# Altium project PCB_Project1.PrjPCB
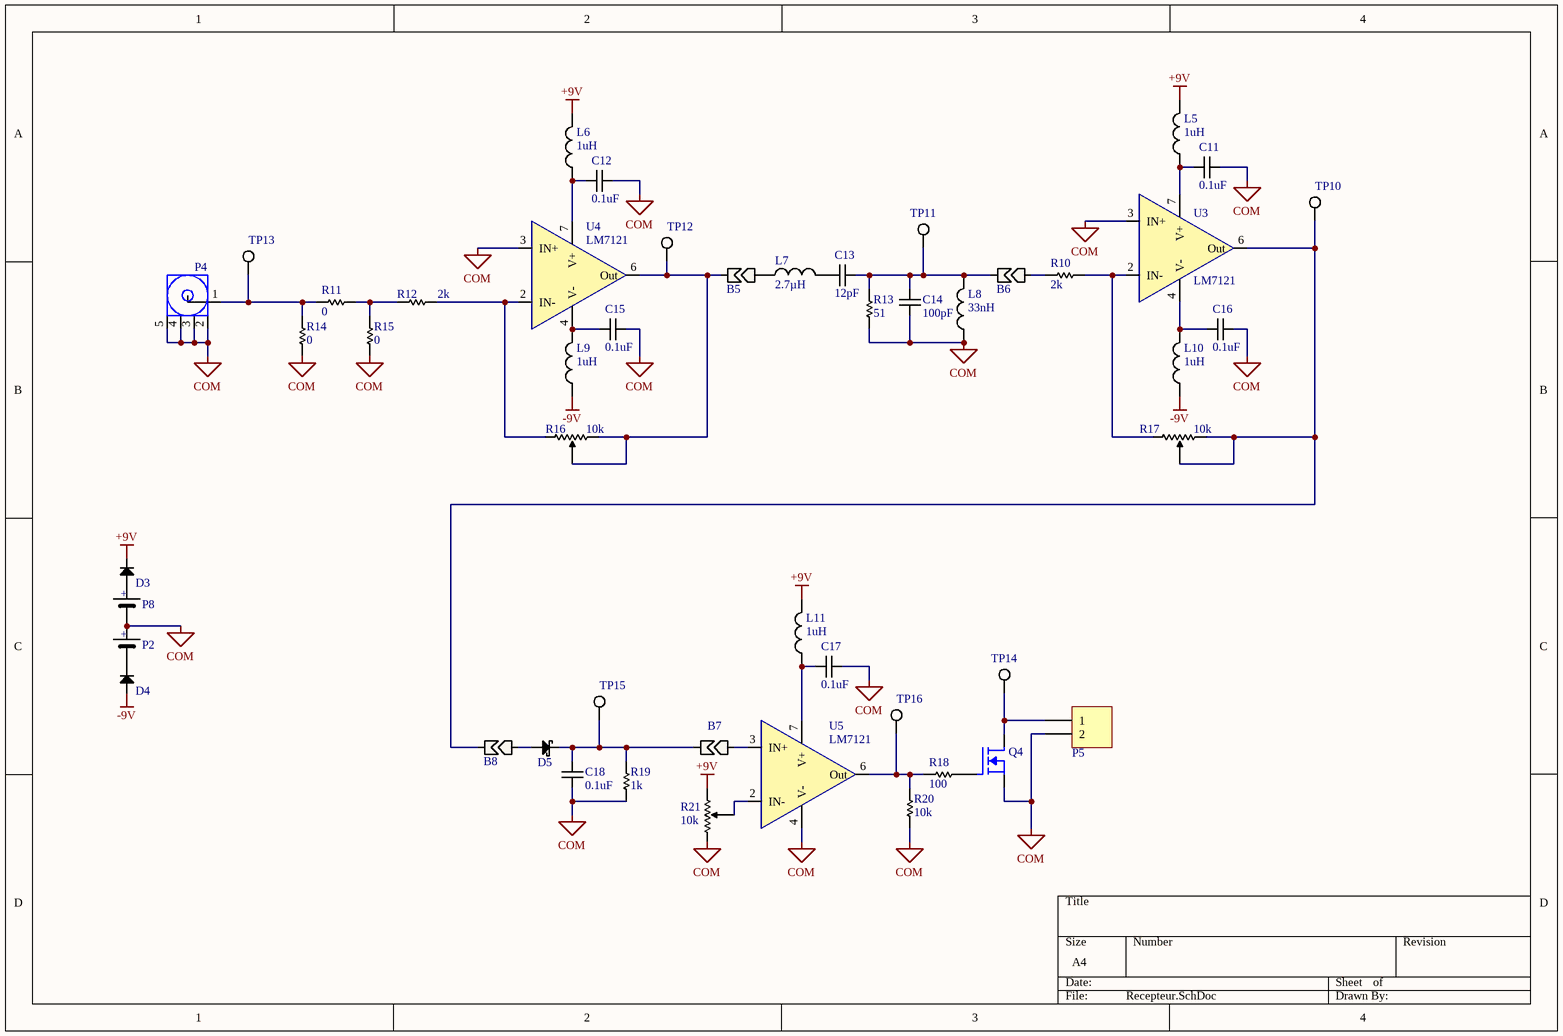
[diagram p0: Recepteur.SchDoc]
2 sheets, 98 parts. Net scope: global (net labels, ports and power ports of the same name join across sheets).
Sheets:
  Recepteur.SchDoc
  Emetteur.SchDoc

## Sheet Recepteur.SchDoc
size A4

### Parts
B5  BRIDGE  [BRIDGE_SMALL]  (value not drawn)
B6  BRIDGE  [BRIDGE_SMALL]  (value not drawn)
B7  BRIDGE  [BRIDGE_SMALL]  (value not drawn)
B8  BRIDGE  [BRIDGE_SMALL]  (value not drawn)
C11  0.1uF  [0805 - Cap Non-Polarized]
C12  0.1uF  [0805 - Cap Non-Polarized]
C13  12pF  [0805 - Cap Non-Polarized]
C14  100pF  [0805 - Cap Non-Polarized]
C15  0.1uF  [0805 - Cap Non-Polarized]
C16  0.1uF  [0805 - Cap Non-Polarized]
C17  0.1uF  [0805 - Cap Non-Polarized]
C18  0.1uF  [0805 - Cap Non-Polarized]
D3  Diode  [DOS-214AC (SMA)]  (value not drawn)
D4  Diode  [DOS-214AC (SMA)]  (value not drawn)
D5  Diode Schottky  [SMBflat]  (value not drawn)
L5  1uH  [1008 - INDUCTOR]
L6  1uH  [1008 - INDUCTOR]
L7  2.7µH  [1812 - Inductor]
L8  33nH  [1008 - INDUCTOR]
L9  1uH  [1008 - INDUCTOR]
L10  1uH  [1008 - INDUCTOR]
L11  1uH  [1008 - INDUCTOR]
P2  Battery Holder  [Battery Holder - 9V - THT]  (value not drawn)
P4  Coax-F  [Coax-BNC-THT-Vertical]  (value not drawn)
P5  Header 1X2  [Headers - 1x2 - R/A - Lock]  (value not drawn)
P8  Battery Holder  [Battery Holder - 9V - THT]  (value not drawn)
Q4  MOSFET_N  [SOT23-3]  (value not drawn)
R10  2k  [0805 - Resistor]
R11  0  [0805 - Resistor]
R12  2k  [0805 - Resistor]
R13  51  [0805 - Resistor]
R14  0  [0805 - Resistor]
R15  0  [0805 - Resistor]
R16  value 10k  [TT-67Y]  (hidden comment: Pot)
R17  value 10k  [TT-67Y]  (hidden comment: Pot)
R18  100  [0805 - Resistor]
R19  1k  [0805 - Resistor]
R20  10k  [0805 - Resistor]
R21  value 10k  [TT-67Y]  (hidden comment: Pot)
TP10  TP  [TP-THT-Vertical-1]  (value not drawn)
TP11  TP  [TP-THT-Vertical-1]  (value not drawn)
TP12  TP  [TP-THT-Vertical-1]  (value not drawn)
TP13  TP  [TP-THT-Vertical-1]  (value not drawn)
TP14  TP  [TP-THT-Vertical-1]  (value not drawn)
TP15  TP  [TP-THT-Vertical-1]  (value not drawn)
TP16  TP  [TP-THT-Vertical-1]  (value not drawn)
U3  LM7121  [SOIC8 - 0.150]
U4  LM7121  [SOIC8 - 0.150]
U5  LM7121  [SOIC8 - 0.150]

### Nets
+9V: D3.2(K) L5.2 L6.2 L11.2 R21.1
-9V: D4.1(A) L9.1 L10.1
COM: C11.2 C12.2 C14.1 C15.2 C16.2 C17.2 C18.1 L8.1 P2.1(+) P4.2(GND) P4.3(GND) P4.4(GND) P4.5(GND) P5.2 P8.2(-) Q4.2(S) R13.1 R14.1 R15.2 R19.1 R20.1 R21.3 U3.3(IN+) U4.3(IN+) U5.4(V-)
NetB5_1: B5.1 R16.1 R16.2(Wiper) TP12.1 U4.6(Out)
NetB5_2: B5.2 L7.1
NetB6_1: B6.1 C13.2 C14.2 L8.2 R13.2 TP11.1
NetB6_2: B6.2 R10.2
NetB7_1: B7.1 C18.2 D5.2(K) R19.2 TP15.1
NetB7_2: B7.2 U5.3(IN+)
NetB8_1: B8.1 R17.1 R17.2(Wiper) TP10.1 U3.6(Out)
NetB8_2: B8.2 D5.1(A)
NetC11_1: C11.1 L5.1 U3.7(V+)
NetC12_1: C12.1 L6.1 U4.7(V+)
NetC13_1: C13.1 L7.2
NetC15_1: C15.1 L9.2 U4.4(V-)
NetC16_1: C16.1 L10.2 U3.4(V-)
NetC17_1: C17.1 L11.1 U5.7(V+)
NetD3_1: D3.1(A) P8.1(+)
NetD4_2: D4.2(K) P2.2(-)
NetP4_1: P4.1(Signal) R11.1 R14.2 TP13.1
NetP5_1: P5.1 Q4.3(D) TP14.1
NetQ4_1: Q4.1(G) R18.1
NetR10_1: R10.1 R17.3 U3.2(IN-)
NetR11_2: R11.2 R12.2 R15.1
NetR12_1: R12.1 R16.3 U4.2(IN-)
NetR18_2: R18.2 R20.2 TP16.1 U5.6(Out)
NetR21_2: R21.2(Wiper) U5.2(IN-)

### Library data of the parts
B5-B8 = Jumper-solder: Solder Jumper Bridge; Part Number: Jumper-solder; Category: Jumper; Sub Category: Jumper; Pin count: 2; Created by: Fred; Height: 1mm
C11 C12 C15-C18 = Cap-TDK-CGA-0.1uF-0805: CAP CER 0.1UF 100V 10% X7R 0805; Manufacturer: TDK; Manufacturer No: CGA4J2X7R2A104K125AA; Sub Category: 0805; Part Number: Cap-TDK-CGA-0.1uF-0805; Category: Capacitor; Pin count: 2; Package: 0805; Series: CGA; Supplier 1: Digi-Key; Supplier Part Number 1: 445-5827-1-ND; ComponentLink1URL: http://product.tdk.com/capacitor/mlcc/en/documents/mlcc_automotive_midvoltage_en.pdf; ComponentLink1Description: Datasheet; Creation Date: 2013-09-19 19:23:33; Created by: Pier-Yves; Value: 0.1uF; Tolerance: 10%; Height: 1.45mm; Voltage: 100V; Temperature: -55°C ~ 125°C
C13 = Cap-TDK-CGA-12pF-0805: CAP CER 12PF 100V 5% NP0 0603; Manufacturer: TDK; Manufacturer No: CGA3E2C0G2A120J080AA; Sub Category: 0805; Part Number: Cap-TDK-CGA-12pF-0805; Category: Capacitor; Pin count: 2; Package: 0805; Series: CGA; Supplier 1: Digi-Key; Supplier Part Number 1: 445-12319-1-ND; ComponentLink1URL: http://product.tdk.com/capacitor/mlcc/en/documents/mlcc_automotive_midvoltage_en.pdf; ComponentLink1Description: Datasheet; Creation Date: 2013-09-25 17:50:57; Created by: Pier-Yves; Value: 12pF; Tolerance: ±5%; Height: 1.45mm; Voltage: 100V; Temperature: MLCC
C14 = Cap-TDK-CGA-100pF-0805: CAP CER 100PF 100V 5% NP0 0805; Manufacturer: TDK; Manufacturer No: CGA4C2C0G2A101J060AA; Sub Category: 0805; Part Number: Cap-TDK-CGA-100pF-0805; Category: Capacitor; Pin count: 2; Package: 0805; Series: CGA; Supplier 1: Digi-Key; Supplier Part Number 1: 445-6951-1-ND; ComponentLink1URL: http://product.tdk.com/capacitor/mlcc/en/documents/mlcc_automotive_midvoltage_en.pdf; ComponentLink1Description: Datasheet; Creation Date: 2013-09-19 19:23:33; Created by: Pier-Yves; Value: 100pF; Tolerance: 5%; Height: 1.45mm; Voltage: 100V; Temperature: MLCC
D3 D4 = S1M-13-F: DIODE GEN PURPOSE 1000V 1A SMA; Manufacturer: Diodes Inc.; Manufacturer No: BAS21LT3G; Sub Category: Single; Value: 1.1V@1A; Voltage: 1.1V @ 1A; Part Number: S1M-13-F; Category: Diode; Pin count: 2; Package: SMA; Supplier 1: Digi-Key; Supplier Part Number 1: S1M-FDICT-ND; ComponentLink1URL: http://www.diodes.com/datasheets/ds16003.pdf; ComponentLink1Description: Datasheet; Creation Date: 2013-10-21 20:14:01; Created by: Pier-Yves; Current: 1A; Temperature: -55°C ~ 150°C
D5 = STPS2L40UF: DIODE SCHOTTKY 40V 2A SMBFLAT; Manufacturer: STMicroelectronics; Sub Category: Shottky; Value: 430mV @ 2A; Part Number: STPS2L40UF; Category: Diode; Pin count: 2; Package: SMBflat; Manufacturer No: STPS2L40UF; Supplier 1: Digi-Key; Supplier Part Number 1: 497-8031-1-ND; ComponentLink1URL: http://www.st.com/web/en/resource/technical/document/datasheet/CD00002299.pdf; ComponentLink1Description: Datasheet; Creation Date: 2013-11-30 15:18:00; Created by: Pier-Yves; Height: 1.1mm; Voltage: 430mV @ 2A; Current: 2A; Temperature: 150°C
L5 L6 L9-L11 = Murata-LQW2UA-Ind-AirCore-1uH: IND 1000NH 370MA SRF 290MHZ 1008; Manufacturer: Murata Electronics North America; Manufacturer No: LQW2UAS1R0J00L; Sub Category: SMD; Tolerance: 5%; Part Number: Murata-LQW2UA-Ind-AirCore-1uH; Category: Inductor; Pin count: 2; Package: 2520; Series: LQW2UA; Supplier 1: Digi-Key; Supplier Part Number 1: 490-5706-1-ND; ComponentLink1URL: http://search.murata.co.jp/Ceramy/image/img/PDF/ENG/L0075S0080LQW2UA.pdf; ComponentLink1Description: Datasheet; Creation Date: 2013-09-12 02:00:35; Created by: Frederic; Value: 1uH; Height: 1.83mm; Current: 370mA; Temperature: -55°C ~ 125°C
L7 = Ind-Panasonic-FB-2.7µH-1812: INDUCTOR 2.7 UH 10% 1812 SMD; Manufacturer: Panasonic Electronic Components; Manufacturer No: ELJ-FB2R7KF; Sub Category: 1812; Current: 400mA; Part Number: Ind-Panasonic-FB-2.7µH-1812; Category: Inductor; Pin count: 2; Package: 1812; Series: FB; Supplier 1: Digi-Key; Supplier Part Number 1: PCD1446CT-ND; ComponentLink1URL: http://industrial.panasonic.com/www-cgi/jvcr13pz.cgi?E+PZ+3+AGA0031+ELJFB2R7KF+7+WW; ComponentLink1Description: Datasheet; Creation Date: 2013-09-26 18:57:04; Created by: Pier-Yves; Value: 2.7µH; Tolerance: ±10%; Height: 3.4mm; Temperature: -20°C ~ 85°C
L8 = Murata-LQW2UA-Ind-AirCore-33nH: IND 33NH 1000MA SRF 1600MHZ 1008; Manufacturer: Murata Electronics North America; Manufacturer No: LQW2UAS33NJ00L; Sub Category: SMD; Tolerance: 5%; Current: 1A; Part Number: Murata-LQW2UA-Ind-AirCore-33nH; Category: Inductor; Pin count: 2; Package: 2520; Series: LQW2UA; Supplier 1: Digi-Key; Supplier Part Number 1: 490-5685-1-ND; ComponentLink1URL: http://search.murata.co.jp/Ceramy/image/img/PDF/ENG/L0075S0080LQW2UA.pdf; ComponentLink1Description: Datasheet; Creation Date: 2013-09-12 02:00:31; Created by: Frederic; Value: 33nH; Height: 1.83mm; Temperature: -55°C ~ 125°C
P2 P8 = Battery Holder-9V-THT-Open: HOLDER BATTERY 9V PC MOUNT; Manufacturer: MPD; Manufacturer No: BC9VPC; Part Number: Battery Holder-9V-THT-Open; Category: Battery Holder; Pin count: 2; Supplier 1: Digi-Key; Supplier Part Number 1: BC9VPC-ND; ComponentLink1URL: http://www.memoryprotectiondevices.com/datasheets/BC9VPC-datasheet.pdf; ComponentLink1Description: Datasheet; Creation Date: 2013-10-01 13:40:00; Created by: Pier-Yves; Value: 9V; Height: 21.41mm; Voltage: 9V
P4 = coax-bnc-tht-vertical: CONN BNC JACK STR 50 OHM PCB; Manufacturer: TE Connectivity; Manufacturer No: 5-1634503-1; Sub Category: Coaxial; Value: 50Ohms; Part Number: coax-bnc-tht-vertical; Category: Connector; Pin count: 5; Series: AMP; Supplier 1: Digi-Key; Supplier Part Number 1: A97581-ND; ComponentLink1URL: http://www.te.com/commerce/DocumentDelivery/DDEController?Action=srchrtrv&DocNm=1634503&DocType=Customer+Drawing&DocLang=English; ComponentLink1Description: Datasheet; Creation Date: 2013-11-24 21:41:14; Created by: Pier-Yves; Temperature: -55°C ~ 85°C
P5 = Header-0.100-R/A-Lock-1X2: Manufacturer: Molex Inc.; Manufacturer No: 0705530001; Sub Category: 100mils R/A lock; LatestRevisionDate: 17-Jul-2002; LatestRevisionNote: Re-released for DXP Platform.; Publisher: Altium Limited; Part Number: Header-0.100-R/A-Lock-1X2; Category: Header; Pin count: 2; Series: C-Grid® SL™ 70553; Supplier 1: Digi-Key; Supplier Part Number 1: WM4900-ND; ComponentLink1URL: http://www.molex.com/pdm_docs/sd/705530001_sd.pdf; ComponentLink1Description: Datasheet; Creation Date: 2013-06-28 14:36:17; Created by: Pier-Yves
Q4 = 2N7002: MosFET Channel-N SOT-23-3 3.3A; Part Number: 2N7002; Manufacturer: Vishay Siliconix; Manufacturer No: SI2304DDS-T1-GE3; Sub Category: MOSFET-N; Value: Channel N; Power: 1.7W; Voltage: 30V; Category: Transistor; Pin count: 3; Package: SOT-23-3; Series: ÉTrenchFET; Supplier 1: Digi-Key; Supplier Part Number 1: SI2304DDS-T1-GE3CT-ND; ComponentLink1URL: http://www.vishay.com/docs/65175/si2304dd.pdf; ComponentLink1Description: Datasheet; Creation Date: 2013-06-28 13:51:31; Created by: Pier-Yves; Current: 3.3A
R10 R12 = Yagao-RC0805-2k: RES 2.0K OHM 1/8W 5% 0805 SMD; Manufacturer: Yagao; Manufacturer No: RC0805JR-072KL; Sub Category: 0805; Part Number: Yagao-RC0805-2k; Category: Resistor; Pin count: 2; Package: 0805; Series: RC0805; Supplier 1: Digi-Key; Supplier Part Number 1: 311-2.0KARCT-ND; ComponentLink1URL: http://media.digikey.com/pdf/Data%20Sheets/Yageo%20PDFs/RC0805%20Pb%20Free.pdf; ComponentLink1Description: Datasheet; Creation Date: 2013-06-28 03:21:03; Created by: Pier-Yves; Value: 2k; Tolerance: 5%; Power: 1/8W; Height: 0.6mm
R11 R14 R15 = Jumper-0805: RES 0.0 OHM 1/8W JUMP 0805; Manufacturer: Stackpole electronic; Manufacturer No: RMCF0805ZT0R00; Sub Category: 0805; Current: 2A; Part Number: Jumper-0805; Category: Resistor; Pin count: 2; Package: 0805; Series: RMFC; Supplier 1: Digi-Key; Supplier Part Number 1: RMCF0805ZT0R00CT-ND; ComponentLink1URL: http://www.seielect.com/Catalog/SEI-RMCF_RMCP.pdf; ComponentLink1Description: Datasheet; Creation Date: 2013-09-21 02:33:24; Created by: Pier-Yves; Value: 0; Power: 1/8W; Height: 0.65mm
R13 = Yagao-RC0805-51: RES 51 OHM 1/8W 5% 0805 SMD; Manufacturer: Yagao; Manufacturer No: RC0805JR-0751RL; Sub Category: 0805; Part Number: Yagao-RC0805-51; Category: Resistor; Pin count: 2; Package: 0805; Series: RC0805; Supplier 1: Digi-Key; Supplier Part Number 1: 311-51ARCT-ND; ComponentLink1URL: http://media.digikey.com/pdf/Data%20Sheets/Yageo%20PDFs/RC0805%20Pb%20Free.pdf; ComponentLink1Description: Datasheet; Creation Date: 2013-06-28 03:21:03; Created by: Pier-Yves; Value: 51; Tolerance: 5%; Power: 1/8W; Height: 0.6mm
R16 R17 R21 = Pot-TT67Y-20Turns-THT-10%-10k: TRIMMER 10K OHM 0.5W TH; Manufacturer: TT Electronics; Manufacturer No: 67YR10KLF; Sub Category: Through Hole; Tolerance: 10%; Power: 1/2W; Part Number: Pot-TT67Y-20Turns-THT-10%-10k; Category: Potentiometer; Pin count: 3; Series: 67; Supplier 1: Digi-Key; Supplier Part Number 1: 987-1098-ND; ComponentLink1URL: http://www.bitechnologies.com/pdfs/67.pdf; ComponentLink1Description: Datasheet; Creation Date: 2013-11-26 20:09:06; Created by: Pier-Yves; Height: 10.4mm
R18 = Yagao-RC0805-100: RES 100 OHM 1/8W 5% 0805 SMD; Manufacturer: Yagao; Manufacturer No: RC0805JR-07100RL; Sub Category: 0805; Part Number: Yagao-RC0805-100; Category: Resistor; Pin count: 2; Package: 0805; Series: RC0805; Supplier 1: Digi-Key; Supplier Part Number 1: 311-100ARCT-ND; ComponentLink1URL: http://media.digikey.com/pdf/Data%20Sheets/Yageo%20PDFs/RC0805%20Pb%20Free.pdf; ComponentLink1Description: Datasheet; Creation Date: 2013-06-28 03:21:03; Created by: Pier-Yves; Value: 100; Tolerance: 5%; Power: 1/8W; Height: 0.6mm
R19 = Yagao-RC0805-1k: RES 1.0K OHM 1/8W 5% 0805 SMD; Manufacturer: Yagao; Manufacturer No: RC0805JR-071KL; Sub Category: 0805; Part Number: Yagao-RC0805-1k; Category: Resistor; Pin count: 2; Package: 0805; Series: RC0805; Supplier 1: Digi-Key; Supplier Part Number 1: 311-1.0KARCT-ND; ComponentLink1URL: http://media.digikey.com/pdf/Data%20Sheets/Yageo%20PDFs/RC0805%20Pb%20Free.pdf; ComponentLink1Description: Datasheet; Creation Date: 2013-06-28 03:21:03; Created by: Pier-Yves; Value: 1k; Tolerance: 5%; Power: 1/8W; Height: 0.6mm
R20 = Yagao-RC0805-10k: RES 10K OHM 1/8W 5% 0805 SMD; Manufacturer: Yagao; Manufacturer No: RC0805JR-0710KL; Sub Category: 0805; Part Number: Yagao-RC0805-10k; Category: Resistor; Pin count: 2; Package: 0805; Series: RC0805; Supplier 1: Digi-Key; Supplier Part Number 1: 311-10KARCT-ND; ComponentLink1URL: http://media.digikey.com/pdf/Data%20Sheets/Yageo%20PDFs/RC0805%20Pb%20Free.pdf; ComponentLink1Description: Datasheet; Creation Date: 2013-06-28 03:21:03; Created by: Pier-Yves; Value: 10k; Tolerance: 5%; Power: 1/8W; Height: 0.6mm
TP10-TP16 = TP-THT-Vertical-1: TEST POINT PC COMPACT .063"D BLK; Manufacturer: Keystone Electronics; Manufacturer No: 5006; Part Number: TP-THT-Vertical-1; Category: Test Point; Pin count: 1; Series: THM; Supplier 1: Digi-Key; Supplier Part Number 1: 5006K-ND; ComponentLink1URL: http://www.keyelco.com/userAssets/file/M60-2p60.pdf; ComponentLink1Description: Datasheet; Creation Date: 2013-11-26 21:36:04; Created by: Pier-Yves; Height: 5.6mm
U3-U5 = LM7121-8SOIC: IC OPAMP VFB 175MHZ 8SOIC; Manufacturer: Texas Instrument; Manufacturer No: LM7121IM/NOPB; Voltage: ±2.25V ~ 16.5V; Part Number: LM7121-8SOIC; Category: IC; Sub Category: OpAmp; Pin count: 8; Package: SOIC-8; Supplier 1: Digi-Key; Supplier Part Number 1: LM7121IM/NOPB-ND; ComponentLink1URL: http://www.ti.com/lit/ds/symlink/lm7121.pdf; ComponentLink1Description: Datasheet; Creation Date: 2013-11-26 17:11:13; Created by: Pier-Yves; Temperature: -40°C ~ 85°C

## Sheet Emetteur.SchDoc
size A4
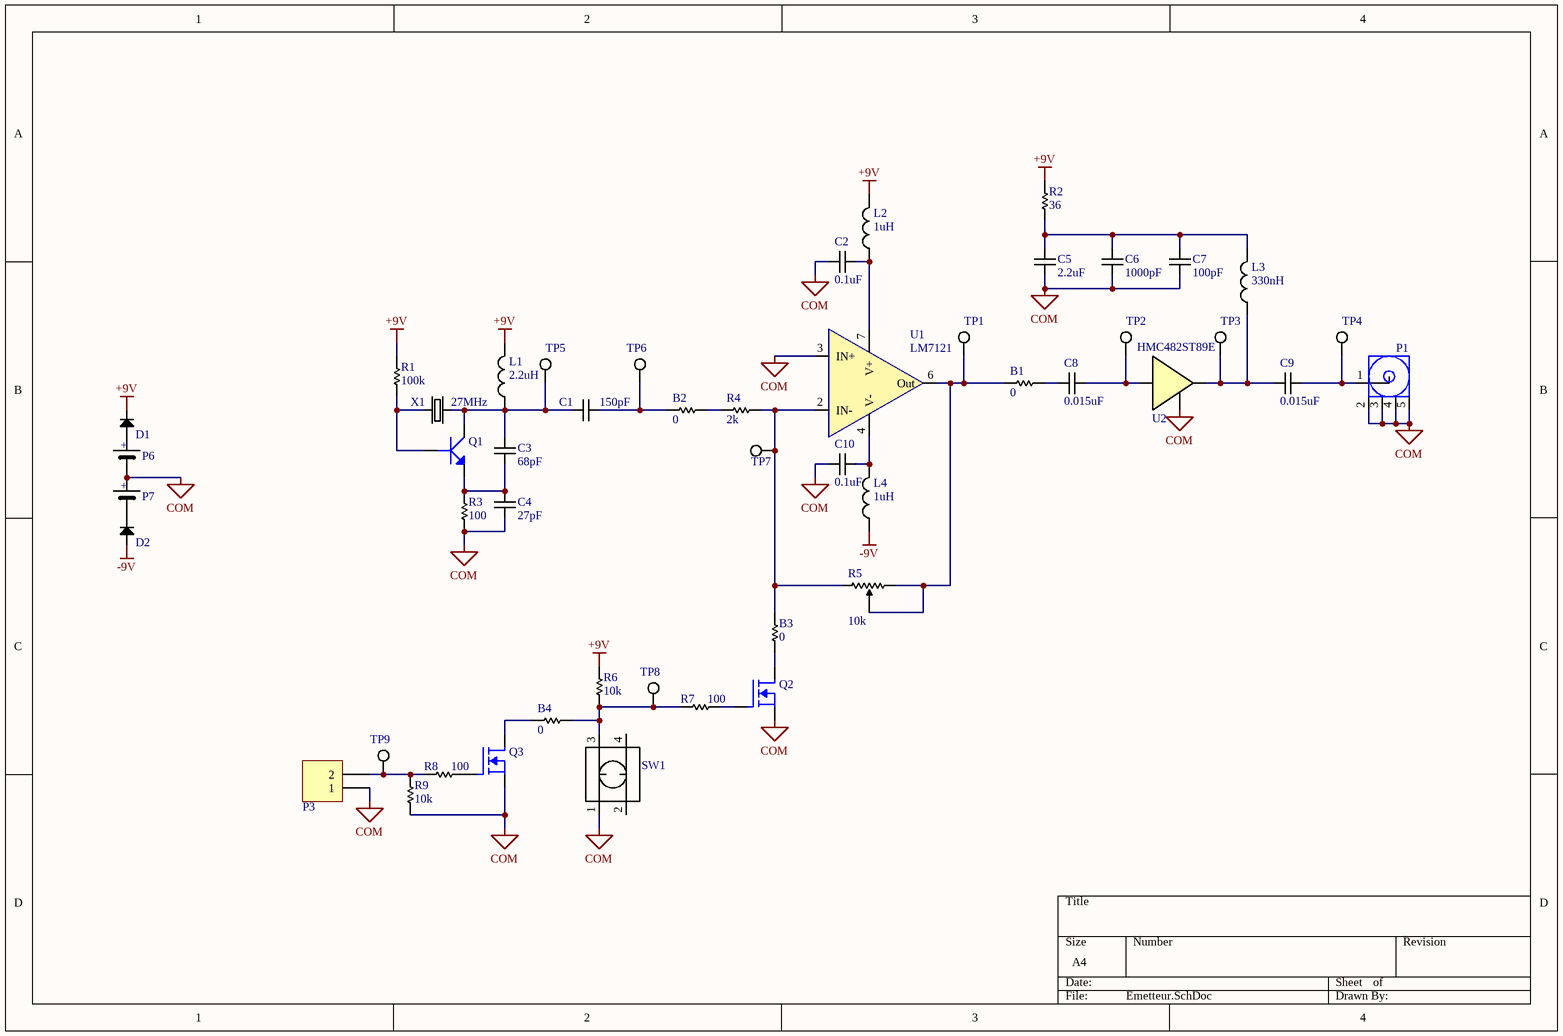
[diagram p1: Emetteur.SchDoc]

### Parts
B1  0  [0805 - Resistor]
B2  0  [0805 - Resistor]
B3  0  [0805 - Resistor]
B4  0  [0805 - Resistor]
C1  value 150pF  [0805 - Cap Non-Polarized]  (hidden comment: Cap)
C2  0.1uF  [0805 - Cap Non-Polarized]
C3  value 68pF  [0805 - Cap Non-Polarized]  (hidden comment: Cap)
C4  value 27pF  [0805 - Cap Non-Polarized]  (hidden comment: Cap)
C5  2.2uF  [0805 - Cap Non-Polarized]
C6  1000pF  [0805 - Cap Non-Polarized]
C7  100pF  [0805 - Cap Non-Polarized]
C8  0.015uF  [0805 - Cap Non-Polarized]
C9  0.015uF  [0805 - Cap Non-Polarized]
C10  0.1uF  [0805 - Cap Non-Polarized]
D1  Diode  [DOS-214AC (SMA)]  (value not drawn)
D2  Diode  [DOS-214AC (SMA)]  (value not drawn)
L1  value 2.2uH  [1008 - INDUCTOR]  (hidden comment: Inductor)
L2  1uH  [1008 - INDUCTOR]
L3  330nH  [1008 - INDUCTOR]
L4  1uH  [1008 - INDUCTOR]
P1  Coax-F  [Coax-BNC-THT-Vertical]  (value not drawn)
P3  Header 1X2  [Headers - 1x2 - R/A - Lock]  (value not drawn)
P6  Battery Holder  [Battery Holder - 9V - THT]  (value not drawn)
P7  Battery Holder  [Battery Holder - 9V - THT]  (value not drawn)
Q1  NPN  [SOT23-3]  (value not drawn)
Q2  MOSFET_N  [SOT23-3]  (value not drawn)
Q3  MOSFET_N  [SOT23-3]  (value not drawn)
R1  value 100k  [0805 - Resistor]  (hidden comment: Res)
R2  36  [2512 - Resistor]
R3  value 100  [0805 - Resistor]  (hidden comment: Res)
R4  2k  [0805 - Resistor]
R5  value 10k  [TT-67Y]  (hidden comment: Pot)
R6  10k  [0805 - Resistor]
R7  100  [0805 - Resistor]
R8  100  [0805 - Resistor]
R9  10k  [0805 - Resistor]
SW1  Tact Switch 4  [TE FSMJSMA]  (value not drawn)
TP1  TP  [TP-THT-Vertical-1]  (value not drawn)
TP2  TP  [TP-THT-Vertical-1]  (value not drawn)
TP3  TP  [TP-THT-Vertical-1]  (value not drawn)
TP4  TP  [TP-THT-Vertical-1]  (value not drawn)
TP5  TP  [TP-THT-Vertical-1]  (value not drawn)
TP6  TP  [TP-THT-Vertical-1]  (value not drawn)
TP7  TP  [TP-THT-Vertical-1]  (value not drawn)
TP8  TP  [TP-THT-Vertical-1]  (value not drawn)
TP9  TP  [TP-THT-Vertical-1]  (value not drawn)
U1  LM7121  [SOIC8 - 0.150]
U2  Manufacturer No: HMC482ST89E  [SOT-89]  (hidden comment: Buffer)
X1  value 27MHz  [HC49US]  (hidden comment: HC49US)

### Nets
+9V: D1.2(K) L1.2 L2.2 R1.2 R2.1 R6.2
-9V: D2.1(A) L4.1
COM: C2.1 C4.1 C5.1 C6.1 C7.1 C10.1 P1.2(GND) P1.3(GND) P1.4(GND) P1.5(GND) P3.1 P6.2(-) P7.1(+) Q2.2(S) Q3.2(S) R3.1 R9.1 SW1.1 U1.3(IN+) U2.2(Gnd)
NetB1_1: B1.1 R5.1 R5.2(Wiper) TP1.1 U1.6(Out)
NetB1_2: B1.2 C8.1
NetB2_1: B2.1 C1.2 TP6.1
NetB2_2: B2.2 R4.2
NetB3_1: B3.1 Q2.3(D)
NetB3_2: B3.2 R4.1 R5.3 TP7.1 U1.2(IN-)
NetB4_1: B4.1 Q3.3(D)
NetB4_2: B4.2 R6.1 R7.1 SW1.3 TP8.1
NetC1_1: C1.1 C3.2 L1.1 Q1.3(C) TP5.1 X1.2
NetC2_2: C2.2 L2.1 U1.7(V+)
NetC3_1: C3.1 C4.2 Q1.2(E) R3.2
NetC5_2: C5.2 C6.2 C7.2 L3.2 R2.2
NetC8_2: C8.2 TP2.1 U2.1(In)
NetC9_1: C9.1 L3.1 TP3.1 U2.3(Out)
NetC9_2: C9.2 P1.1(Signal) TP4.1
NetC10_2: C10.2 L4.2 U1.4(V-)
NetD1_1: D1.1(A) P6.1(+)
NetD2_2: D2.2(K) P7.2(-)
NetP3_2: P3.2 R8.1 R9.2 TP9.1
NetQ1_1: Q1.1(B) R1.1 X1.1
NetQ2_1: Q2.1(G) R7.2
NetQ3_1: Q3.1(G) R8.2

Not connected (* = marked no-connect by the designer): SW1 2 4

### Library data of the parts
B1-B4 = Jumper-0805: as R11 on sheet Recepteur; Part Number: Jumper-0805; Category: Resistor; Pin count: 2; Package: 0805; Series: RMFC; Supplier 1: Digi-Key; Supplier Part Number 1: RMCF0805ZT0R00CT-ND; ComponentLink1URL: http://www.seielect.com/Catalog/SEI-RMCF_RMCP.pdf; ComponentLink1Description: Datasheet; Creation Date: 2013-09-21 02:33:24; Created by: Pier-Yves; Value: 0; Power: 1/8W; Height: 0.65mm
C1 = Cap-TDK-CGA-150pF-0805: CAP CER 150PF 250V 5% NP0 0603; Manufacturer: TDK; Manufacturer No: CGA3E3C0G2E151J080AA; Sub Category: 0805; Part Number: Cap-TDK-CGA-150pF-0805; Category: Capacitor; Pin count: 2; Package: 0805; Series: CGA; Supplier 1: Digi-Key; Supplier Part Number 1: 445-5740-1-ND; ComponentLink1URL: http://product.tdk.com/capacitor/mlcc/en/documents/mlcc_automotive_midvoltage_en.pdf; ComponentLink1Description: Datasheet; Creation Date: 2013-09-25 17:50:57; Created by: Pier-Yves; Tolerance: ±5%; Height: 1.45mm; Voltage: 250V; Temperature: MLCC
C2 C10 = Cap-TDK-CGA-0.1uF-0805: as C11 on sheet Recepteur; Part Number: Cap-TDK-CGA-0.1uF-0805; Category: Capacitor; Pin count: 2; Package: 0805; Series: CGA; Supplier 1: Digi-Key; Supplier Part Number 1: 445-5827-1-ND; ComponentLink1URL: http://product.tdk.com/capacitor/mlcc/en/documents/mlcc_automotive_midvoltage_en.pdf; ComponentLink1Description: Datasheet; Creation Date: 2013-09-19 19:23:33; Created by: Pier-Yves; Value: 0.1uF; Tolerance: 10%; Height: 1.45mm; Voltage: 100V; Temperature: -55°C ~ 125°C
C3 = Cap-TDK-CGA-68pF-0805: CAP CER 68PF 100V 5% NP0 0603; Manufacturer: TDK; Manufacturer No: CGA3E2C0G2A680J080AA; Sub Category: 0805; Part Number: Cap-TDK-CGA-68pF-0805; Category: Capacitor; Pin count: 2; Package: 0805; Series: CGA; Supplier 1: Digi-Key; Supplier Part Number 1: 445-12337-1-ND; ComponentLink1URL: http://product.tdk.com/capacitor/mlcc/en/documents/mlcc_automotive_midvoltage_en.pdf; ComponentLink1Description: Datasheet; Creation Date: 2013-09-25 17:50:57; Created by: Pier-Yves; Tolerance: ±5%; Height: 1.45mm; Voltage: 100V; Temperature: MLCC
C4 = Cap-TDK-CGA-27pF-0805: CAP CER 27PF 50V 5% NP0 0603; Manufacturer: TDK; Manufacturer No: CGA3E2C0G1H270J080AA; Sub Category: 0805; Part Number: Cap-TDK-CGA-27pF-0805; Category: Capacitor; Pin count: 2; Package: 0805; Series: CGA; Supplier 1: Digi-Key; Supplier Part Number 1: 445-5633-1-ND; ComponentLink1URL: http://product.tdk.com/capacitor/mlcc/en/documents/mlcc_automotive_general_en.pdf; ComponentLink1Description: Datasheet; Creation Date: 2013-09-25 17:50:57; Created by: Pier-Yves; Tolerance: ±5%; Height: 1.45mm; Voltage: 50V; Temperature: MLCC
C5 = Cap-Samsung-CL-50V-2.2uF-0805-10%: CAP CER 2.2UF 50V 10% X5R 0805; Manufacturer: Samsung Electro-Mechanics America, Inc; Manufacturer No: CL21A225KB9LNNC; Sub Category: 0805; Part Number: Cap-Samsung-CL-50V-2.2uF-0805-10%; Category: Capacitor; Pin count: 2; Package: 0805; Series: CL; Supplier 1: Digi-Key; Supplier Part Number 1: 1276-2409-1-ND; ComponentLink1URL: http://www.samsungsem.com/servlet/FileDownload?type=spec&file=CL21A225KB9LNNC.pdf; ComponentLink1Description: Datasheet; Creation Date: 2013-11-14 02:22:00; Created by: Pier-Yves; Value: 2.2uF; Tolerance: 10%; Height: 1.45mm; Voltage: 50V; Temperature: -55°C ~ 85°C
C6 = Cap-TDK-CGA-1000pF-0805: CAP CER 1000PF 100V 5% NP0 0805; Manufacturer: TDK; Manufacturer No: CGA4C2C0G2A102J060AA; Sub Category: 0805; Part Number: Cap-TDK-CGA-1000pF-0805; Category: Capacitor; Pin count: 2; Package: 0805; Series: CGA; Supplier 1: Digi-Key; Supplier Part Number 1: 445-5749-1-ND; ComponentLink1URL: http://product.tdk.com/capacitor/mlcc/en/documents/mlcc_automotive_midvoltage_en.pdf; ComponentLink1Description: Datasheet; Creation Date: 2013-09-19 19:23:33; Created by: Pier-Yves; Value: 1000pF; Tolerance: 5%; Height: 1.45mm; Voltage: 100V; Temperature: MLCC
C7 = Cap-TDK-CGA-100pF-0805: as C14 on sheet Recepteur; Part Number: Cap-TDK-CGA-100pF-0805; Category: Capacitor; Pin count: 2; Package: 0805; Series: CGA; Supplier 1: Digi-Key; Supplier Part Number 1: 445-6951-1-ND; ComponentLink1URL: http://product.tdk.com/capacitor/mlcc/en/documents/mlcc_automotive_midvoltage_en.pdf; ComponentLink1Description: Datasheet; Creation Date: 2013-09-19 19:23:33; Created by: Pier-Yves; Value: 100pF; Tolerance: 5%; Height: 1.45mm; Voltage: 100V; Temperature: MLCC
C8 C9 = Cap-TDK-CGA-0.015uF-0805: CAP CER 0.015UF 100V X7R 0805; Manufacturer: TDK; Manufacturer No: CGA4J2X7R2A153K125AA; Sub Category: 0805; Tolerance: 10%; Part Number: Cap-TDK-CGA-0.015uF-0805; Category: Capacitor; Pin count: 2; Package: 0805; Series: CGA; Supplier 1: Digi-Key; Supplier Part Number 1: 445-5822-1-ND; ComponentLink1URL: http://product.tdk.com/capacitor/mlcc/en/documents/mlcc_automotive_midvoltage_en.pdf; ComponentLink1Description: Datasheet; Creation Date: 2013-09-19 19:23:33; Created by: Pier-Yves; Value: 0.015uF; Height: 1.45mm; Voltage: 100V; Temperature: -55°C ~ 125°C
D1 D2 = S1M-13-F: as D3 on sheet Recepteur; Part Number: S1M-13-F; Category: Diode; Pin count: 2; Package: SMA; Supplier 1: Digi-Key; Supplier Part Number 1: S1M-FDICT-ND; ComponentLink1URL: http://www.diodes.com/datasheets/ds16003.pdf; ComponentLink1Description: Datasheet; Creation Date: 2013-10-21 20:14:01; Created by: Pier-Yves; Current: 1A; Temperature: -55°C ~ 150°C
L1 = Murata-LQW2UA-Ind-AirCore-2.2uH: IND 2200NH 280MA SRF 130MHZ 1008; Manufacturer: Murata Electronics North America; Manufacturer No: LQW2UAS2R2J00L; Sub Category: SMD; Tolerance: 5%; Part Number: Murata-LQW2UA-Ind-AirCore-2.2uH; Category: Inductor; Pin count: 2; Package: 2520; Series: LQW2UA; Supplier 1: Digi-Key; Supplier Part Number 1: 490-5710-1-ND; ComponentLink1URL: http://search.murata.co.jp/Ceramy/image/img/PDF/ENG/L0075S0080LQW2UA.pdf; ComponentLink1Description: Datasheet; Creation Date: 2013-09-12 02:00:35; Created by: Frederic; Height: 1.83mm; Current: 280mA; Temperature: -55°C ~ 125°C
L2 L4 = Murata-LQW2UA-Ind-AirCore-1uH: as L5 on sheet Recepteur; Part Number: Murata-LQW2UA-Ind-AirCore-1uH; Category: Inductor; Pin count: 2; Package: 2520; Series: LQW2UA; Supplier 1: Digi-Key; Supplier Part Number 1: 490-5706-1-ND; ComponentLink1URL: http://search.murata.co.jp/Ceramy/image/img/PDF/ENG/L0075S0080LQW2UA.pdf; ComponentLink1Description: Datasheet; Creation Date: 2013-09-12 02:00:35; Created by: Frederic; Value: 1uH; Height: 1.83mm; Current: 370mA; Temperature: -55°C ~ 125°C
L3 = Murata-LQW2UA-Ind-AirCore-330nH: IND 330NH 450MA SRF 570MHZ 1008; Manufacturer: Murata Electronics North America; Manufacturer No: LQW2UASR33J00L; Sub Category: SMD; Tolerance: 5%; Part Number: Murata-LQW2UA-Ind-AirCore-330nH; Category: Inductor; Pin count: 2; Package: 2520; Series: LQW2UA; Supplier 1: Digi-Key; Supplier Part Number 1: 490-5697-1-ND; ComponentLink1URL: http://search.murata.co.jp/Ceramy/image/img/PDF/ENG/L0075S0080LQW2UA.pdf; ComponentLink1Description: Datasheet; Creation Date: 2013-09-12 02:00:33; Created by: Frederic; Value: 330nH; Height: 1.83mm; Current: 450mA; Temperature: -55°C ~ 125°C
P1 = coax-bnc-tht-vertical: as P4 on sheet Recepteur; Part Number: coax-bnc-tht-vertical; Category: Connector; Pin count: 5; Series: AMP; Supplier 1: Digi-Key; Supplier Part Number 1: A97581-ND; ComponentLink1URL: http://www.te.com/commerce/DocumentDelivery/DDEController?Action=srchrtrv&DocNm=1634503&DocType=Customer+Drawing&DocLang=English; ComponentLink1Description: Datasheet; Creation Date: 2013-11-24 21:41:14; Created by: Pier-Yves; Temperature: -55°C ~ 85°C
P3 = Header-0.100-R/A-Lock-1X2: as P5 on sheet Recepteur; LatestRevisionDate: 17-Jul-2002; LatestRevisionNote: Re-released for DXP Platform.; Publisher: Altium Limited; Part Number: Header-0.100-R/A-Lock-1X2; Category: Header; Pin count: 2; Series: C-Grid® SL™ 70553; Supplier 1: Digi-Key; Supplier Part Number 1: WM4900-ND; ComponentLink1URL: http://www.molex.com/pdm_docs/sd/705530001_sd.pdf; ComponentLink1Description: Datasheet; Creation Date: 2013-06-28 14:36:17; Created by: Pier-Yves
P6 P7 = Battery Holder-9V-THT-Open: as P2 on sheet Recepteur; Part Number: Battery Holder-9V-THT-Open; Category: Battery Holder; Pin count: 2; Supplier 1: Digi-Key; Supplier Part Number 1: BC9VPC-ND; ComponentLink1URL: http://www.memoryprotectiondevices.com/datasheets/BC9VPC-datasheet.pdf; ComponentLink1Description: Datasheet; Creation Date: 2013-10-01 13:40:00; Created by: Pier-Yves; Value: 9V; Height: 21.41mm; Voltage: 9V
Q1 = MMBT2222A-7-F: TRANS NPN 40V 350MW SMD SOT23-3; Manufacturer: Diodes Inc.; Sub Category: BJT NPN; Power: 300mW; Current: 600mA; Part Number: MMBT2222A-7-F; Category: Transistor; Pin count: 3; Package: SOT-23-3; Manufacturer No: MMBT2222A-7-F; Supplier 1: Digi-Key; Supplier Part Number 1: MMBT2222A-FDICT-ND; ComponentLink1URL: http://www.diodes.com/datasheets/ds30041.pdf; ComponentLink1Description: Datasheet; Creation Date: 2013-09-25 15:47:37; Created by: Pier-Yves
Q2 Q3 = 2N7002: as Q4 on sheet Recepteur; Category: Transistor; Pin count: 3; Package: SOT-23-3; Series: ÉTrenchFET; Supplier 1: Digi-Key; Supplier Part Number 1: SI2304DDS-T1-GE3CT-ND; ComponentLink1URL: http://www.vishay.com/docs/65175/si2304dd.pdf; ComponentLink1Description: Datasheet; Creation Date: 2013-06-28 13:51:31; Created by: Pier-Yves; Current: 3.3A
R1 = Yagao-RC0805-100k: RES 100K OHM 1/8W 5% 0805 SMD; Manufacturer: Yagao; Manufacturer No: RC0805JR-07100KL; Sub Category: 0805; Part Number: Yagao-RC0805-100k; Category: Resistor; Pin count: 2; Package: 0805; Series: RC0805; Supplier 1: Digi-Key; Supplier Part Number 1: 311-100KARCT-ND; ComponentLink1URL: http://media.digikey.com/pdf/Data%20Sheets/Yageo%20PDFs/RC0805%20Pb%20Free.pdf; ComponentLink1Description: Datasheet; Creation Date: 2013-06-28 03:21:03; Created by: Pier-Yves; Tolerance: 5%; Power: 1/8W; Height: 0.6mm
R2 = Rohm-MCR100-36: RES 36 OHM 1W 5% 2512 SMD; Manufacturer: Rohm Semiconductor; Manufacturer No: MCR100JZHJ360; Sub Category: 2512; Part Number: Rohm-MCR100-36; Category: Resistor; Pin count: 2; Package: 0805; Series: MCR100; Supplier 1: Digi-Key; Supplier Part Number 1: RHM36BCCT-ND; ComponentLink1URL: http://rohmfs.rohm.com/en/products/databook/datasheet/passive/resistor/chip_resistor/mcr_g.pdf; ComponentLink1Description: Datasheet; Creation Date: 2013-06-28 12:37:11; Created by: Pier-Yves; Value: 36; Tolerance: 5%; Power: 1W; Height: 0.7mm
R3 R7 R8 = Yagao-RC0805-100: as R18 on sheet Recepteur; Part Number: Yagao-RC0805-100; Category: Resistor; Pin count: 2; Package: 0805; Series: RC0805; Supplier 1: Digi-Key; Supplier Part Number 1: 311-100ARCT-ND; ComponentLink1URL: http://media.digikey.com/pdf/Data%20Sheets/Yageo%20PDFs/RC0805%20Pb%20Free.pdf; ComponentLink1Description: Datasheet; Creation Date: 2013-06-28 03:21:03; Created by: Pier-Yves; Tolerance: 5%; Power: 1/8W; Height: 0.6mm
  R7 R8: Value: 100
R4 = Yagao-RC0805-2k: as R10 on sheet Recepteur; Part Number: Yagao-RC0805-2k; Category: Resistor; Pin count: 2; Package: 0805; Series: RC0805; Supplier 1: Digi-Key; Supplier Part Number 1: 311-2.0KARCT-ND; ComponentLink1URL: http://media.digikey.com/pdf/Data%20Sheets/Yageo%20PDFs/RC0805%20Pb%20Free.pdf; ComponentLink1Description: Datasheet; Creation Date: 2013-06-28 03:21:03; Created by: Pier-Yves; Value: 2k; Tolerance: 5%; Power: 1/8W; Height: 0.6mm
R5 = Pot-TT67Y-20Turns-THT-10%-10k: as R16 on sheet Recepteur; Part Number: Pot-TT67Y-20Turns-THT-10%-10k; Category: Potentiometer; Pin count: 3; Series: 67; Supplier 1: Digi-Key; Supplier Part Number 1: 987-1098-ND; ComponentLink1URL: http://www.bitechnologies.com/pdfs/67.pdf; ComponentLink1Description: Datasheet; Creation Date: 2013-11-26 20:09:06; Created by: Pier-Yves; Height: 10.4mm
R6 R9 = Yagao-RC0805-10k: as R20 on sheet Recepteur; Part Number: Yagao-RC0805-10k; Category: Resistor; Pin count: 2; Package: 0805; Series: RC0805; Supplier 1: Digi-Key; Supplier Part Number 1: 311-10KARCT-ND; ComponentLink1URL: http://media.digikey.com/pdf/Data%20Sheets/Yageo%20PDFs/RC0805%20Pb%20Free.pdf; ComponentLink1Description: Datasheet; Creation Date: 2013-06-28 03:21:03; Created by: Pier-Yves; Value: 10k; Tolerance: 5%; Power: 1/8W; Height: 0.6mm
SW1 = TactSwitch-SMD-Vertical-GullWing-6x6: SWITCH TACTILE SPST-NO 0.05A 12V; Manufacturer: TE Connectivity; Manufacturer No: FSM4JSMATR; Current: 50mA; Part Number: TactSwitch-SMD-Vertical-GullWing-6x6; Category: Switch; Sub Category: Tactile; Pin count: 4; Series: FSMJSMA, Alcoswitch; Supplier 1: Digi-Key; Supplier Part Number 1: 450-1759-1-ND; ComponentLink1URL: http://media.digikey.com/pdf/Data%20Sheets/Tyco%20Electronics%20Alcoswitch%20PDFs/FSM%20Series.pdf; ComponentLink1Description: Datasheet; Creation Date: 2013-10-09 16:09:19; Created by: Pier-Yves; Height: 5mm; Temperature: -35°C ~ 85°C
TP1-TP9 = TP-THT-Vertical-1: as TP10 on sheet Recepteur; Part Number: TP-THT-Vertical-1; Category: Test Point; Pin count: 1; Series: THM; Supplier 1: Digi-Key; Supplier Part Number 1: 5006K-ND; ComponentLink1URL: http://www.keyelco.com/userAssets/file/M60-2p60.pdf; ComponentLink1Description: Datasheet; Creation Date: 2013-11-26 21:36:04; Created by: Pier-Yves; Height: 5.6mm
U1 = LM7121-8SOIC: as U3 on sheet Recepteur; Part Number: LM7121-8SOIC; Category: IC; Sub Category: OpAmp; Pin count: 8; Package: SOIC-8; Supplier 1: Digi-Key; Supplier Part Number 1: LM7121IM/NOPB-ND; ComponentLink1URL: http://www.ti.com/lit/ds/symlink/lm7121.pdf; ComponentLink1Description: Datasheet; Creation Date: 2013-11-26 17:11:13; Created by: Pier-Yves; Temperature: -40°C ~ 85°C
U2 = HMC482ST89E-20dB: IC MMIC AMP HBT 5GHZ SOT-89; Manufacturer: Hittite Microwave Technology; Sub Category: RF Amplifier; Value: 19dB; Voltage: 6 V ~ 12 V; Current: 110mA; Part Number: HMC482ST89E-20dB; Category: IC; Pin count: 3; Package: SOT-89; Supplier 1: Digi-Key; Supplier Part Number 1: 1127-1421-1-ND; ComponentLink1URL: http://www.hittite.com/content/documents/data_sheet/hmc482st89.pdf; ComponentLink1Description: Datasheet; Creation Date: 2013-11-30 11:20:49; Created by: Pier-Yves
X1 = TXC-9C-27MHz: CRYSTAL 27MHZ 18PF SMD; Manufacturer: TXC CORPORATION; Manufacturer No: 9C-27.000MAAJ-T; Tolerance: 30ppm; Part Number: TXC-9C-27MHz; Category: Crystal; Sub Category: Crystal; Pin count: 2; Package: HC49US; Series: 9C; Supplier 1: Digi-Key; Supplier Part Number 1: 887-1070-1-ND; ComponentLink1URL: http://www.txccrystal.com/images/pdf/9c.pdf; ComponentLink1Description: Datasheet; Creation Date: 2013-09-06 04:23:09; Created by: Frederic; Height: 4.1mm; Temperature: -20°C ~ 70°C

## Nets that join several sheets
+9V: Recepteur (5 pins), Emetteur (6 pins)
-9V: Recepteur (D4.1 L9.1 L10.1), Emetteur (D2.1 L4.1)
COM: Recepteur (25 pins), Emetteur (20 pins)